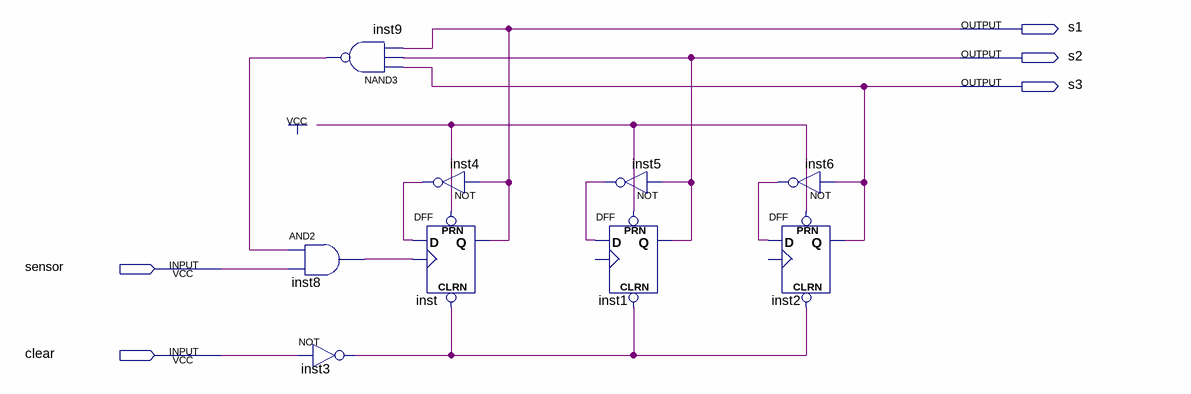
[diagram p0: schematic sheet]
// Quartus schematic pedestriancounter.bdf as structural Verilog: 9 symbols, 5 pins
module pedestriancounter (
  input  sensor,
  input  clear,
  output s1,
  output s2,
  output s3
);

  wire inst3_out, inst4_out, inst5_out, inst6_out, inst8_out, inst9_out, undriven;

  and inst8 (inst8_out, inst9_out, sensor);
  nand inst9 (inst9_out, s3, s2, s1);
  not inst3 (inst3_out, clear);
  not inst4 (inst4_out, s1);
  DFF inst (.CLRN(inst3_out), .CLK(inst8_out), .D(inst4_out), .PRN(undriven), .Q(s1));
  DFF inst1 (.CLRN(inst3_out), .D(inst5_out), .PRN(undriven), .Q(s2));  // open: CLK
  not inst5 (inst5_out, s2);
  not inst6 (inst6_out, s3);
  DFF inst2 (.CLRN(inst3_out), .D(inst6_out), .PRN(undriven), .Q(s3));  // open: CLK
endmodule
